# EAGLE design AS077_DCF77_Empfaenger (EAGLE 9.6.2)
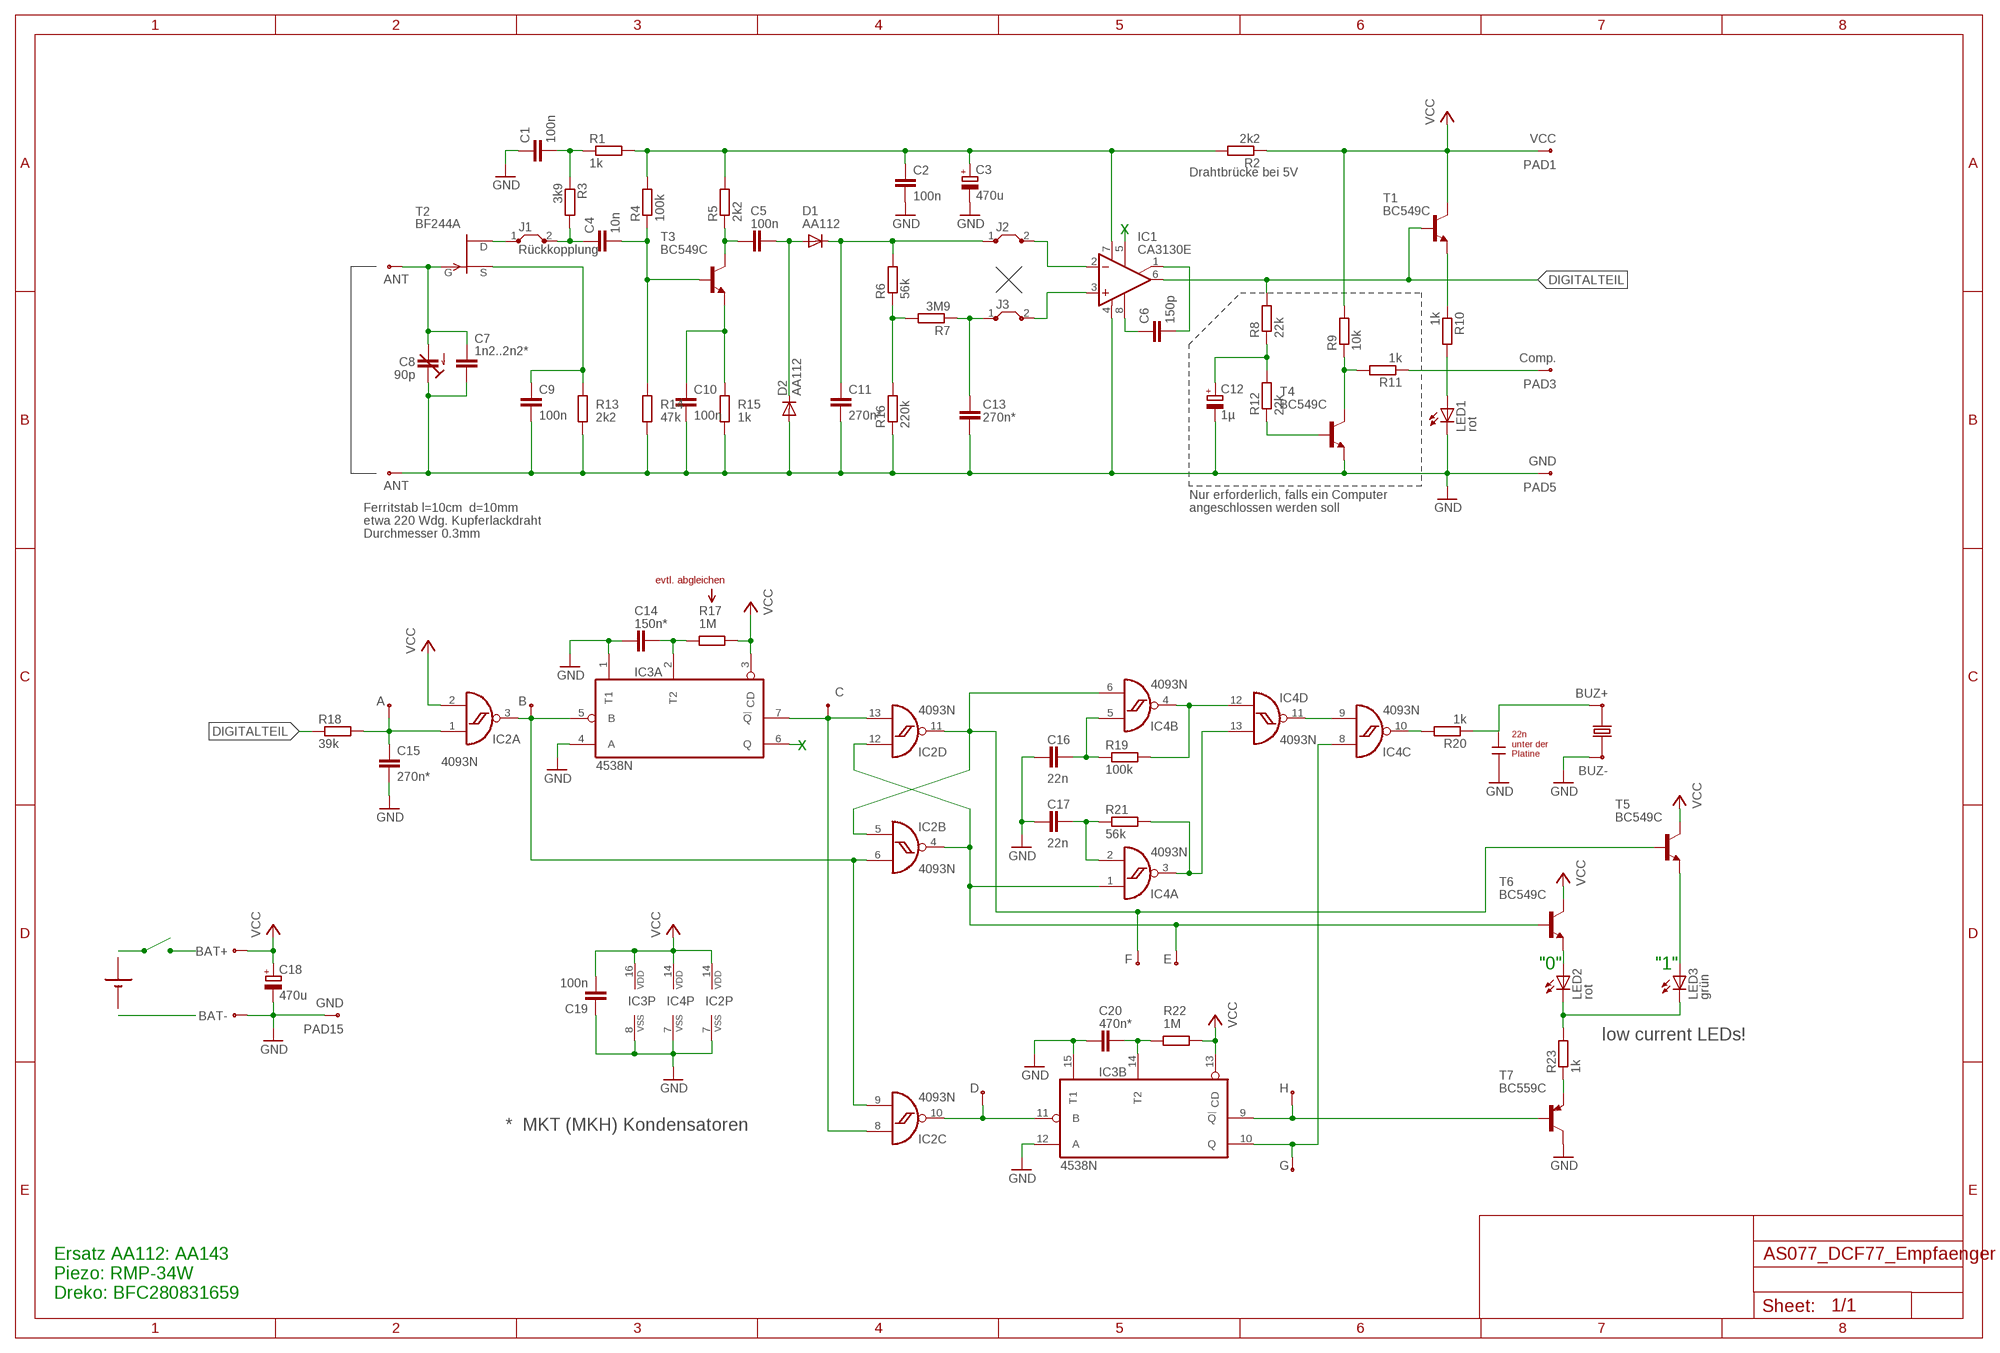
[diagram p0: schematic, sheet 1]

## Parts
C1  100n  RCL_C-EU050-024X044  [RCL_C050-024X044]
C2  100n  RCL_C-EU050-024X044  [RCL_C050-024X044]
C3  470u  RCL_CPOL-EUE5-10.5  [RCL_E5-10,5]
C4  10n  RCL_C-EU050-024X044  [RCL_C050-024X044]
C5  100n  RCL_C-EU050-024X044  [RCL_C050-024X044]
C6  150p  RCL_C-EU050-024X044  [RCL_C050-024X044]
C7  1n2..2n2*  RCL_C-EU075-032X103  [RCL_C075-032X103]
C8  90p  RCL_C-TRIMM808-7.5  [RCL_CTRIM808-BC7.5]
C9  100n  RCL_C-EU050-024X044  [RCL_C050-024X044]
C10  100n  RCL_C-EU050-024X044  [RCL_C050-024X044]
C11  270n*  RCL_C-EU075-032X103  [RCL_C075-032X103]
C12  1µ  RCL_CPOL-EUE5-6  [E5-6]
C13  270n*  RCL_C-EU075-032X103  [RCL_C075-032X103]
C14  150n*  RCL_C-EU075-032X103  [RCL_C075-032X103]
C15  270n*  RCL_C-EU075-032X103  [RCL_C075-032X103]
C16  22n  RCL_C-EU050-024X044  [RCL_C050-024X044]
C17  22n  RCL_C-EU050-024X044  [RCL_C050-024X044]
C18  470u  RCL_CPOL-EUE5-10.5  [RCL_E5-10,5]
C19  100n  RCL_C-EU050-024X044  [RCL_C050-024X044]
C20  470n*  RCL_C-EU075-032X103  [RCL_C075-032X103]
D1  AA112  DIODE_AA112  [DIODE_DO07]
D2  AA112  DIODE_AA112  [DIODE_DO07]
IC1  CA3130E  CA3130N  [DIL08]
IC2  4093N  40XX_4093N  [DIL14]
IC3  4538N  45XX_4538N  [DIL16]
IC4  4093N  40XX_4093N  [DIL14]
J1  Rückkopplung  JUMPER_J5MM  [JUMPER_05]
J2  JUMPER_J5MM  [JUMPER_05]
J3  JUMPER_J5MM  [JUMPER_05]
LED1  rot  LED_LED5MM  [LED_LED5MM]
LED2  rot  LED_LED5MM  [LED_LED5MM]
LED3  grün  LED_LED5MM  [LED_LED5MM]
PAD1  VCC  WIREPAD_2.2/1.3  [WIREPAD_2.2/1.3]
PAD2  ANT  WIREPAD_2.2/1.3  [WIREPAD_2.2/1.3]
PAD3  Comp.  WIREPAD_2.2/1.3  [WIREPAD_2.2/1.3]
PAD4  ANT  WIREPAD_2.2/1.3  [WIREPAD_2.2/1.3]
PAD5  GND  WIREPAD_2.2/1.3  [WIREPAD_2.2/1.3]
PAD6  A  WIREPAD_2.2/1.3  [WIREPAD_2.2/1.3]
PAD7  B  WIREPAD_2.2/1.3  [WIREPAD_2.2/1.3]
PAD8  C  WIREPAD_2.2/1.3  [WIREPAD_2.2/1.3]
PAD9  BUZ-  WIREPAD_2.2/1.3  [WIREPAD_2.2/1.3]
PAD10  BUZ+  WIREPAD_2.2/1.3  [WIREPAD_2.2/1.3]
PAD11  BAT+  WIREPAD_2.2/1.3  [WIREPAD_2.2/1.3]
PAD12  F  WIREPAD_2.2/1.3  [WIREPAD_2.2/1.3]
PAD13  E  WIREPAD_2.2/1.3  [WIREPAD_2.2/1.3]
PAD14  BAT-  WIREPAD_2.2/1.3  [WIREPAD_2.2/1.3]
PAD15  GND  WIREPAD_2.2/1.3  [WIREPAD_2.2/1.3]
PAD16  D  WIREPAD_2.2/1.3  [WIREPAD_2.2/1.3]
PAD17  H  WIREPAD_2.2/1.3  [WIREPAD_2.2/1.3]
PAD18  G  WIREPAD_2.2/1.3  [WIREPAD_2.2/1.3]
Q1  34MM_PIEZO  [34MM_PIEZO_SCREW]
R1  1k  RCL_R-EU_0207/5V  [RCL_0207/5V]
R2  2k2  RCL_R-EU_0207/5V  [RCL_0207/5V]
R3  3k9  RCL_R-EU_0207/15  [RCL_0207/15]
R4  100k  RCL_R-EU_0207/5V  [RCL_0207/5V]
R5  2k2  RCL_R-EU_0207/5V  [RCL_0207/5V]
R6  56k  RCL_R-EU_0207/5V  [RCL_0207/5V]
R7  3M9  RCL_R-EU_0207/5V  [RCL_0207/5V]
R8  22k  RCL_R-EU_0207/5V  [RCL_0207/5V]
R9  10k  RCL_R-EU_0207/5V  [RCL_0207/5V]
R10  1k  RCL_R-EU_0207/5V  [RCL_0207/5V]
R11  1k  RCL_R-EU_0207/5V  [RCL_0207/5V]
R12  22k  RCL_R-EU_0207/5V  [RCL_0207/5V]
R13  2k2  RCL_R-EU_0207/5V  [RCL_0207/5V]
R14  47k  RCL_R-EU_0207/5V  [RCL_0207/5V]
R15  1k  RCL_R-EU_0207/5V  [RCL_0207/5V]
R16  220k  RCL_R-EU_0207/5V  [RCL_0207/5V]
R17  1M  RCL_R-EU_0207/15  [RCL_0207/15]
R18  39k  RCL_R-EU_0207/15  [RCL_0207/15]
R19  100k  RCL_R-EU_0207/5V  [RCL_0207/5V]
R20  1k  RCL_R-EU_0207/5V  [RCL_0207/5V]
R21  56k  RCL_R-EU_0207/5V  [RCL_0207/5V]
R22  1M  RCL_R-EU_0207/15  [RCL_0207/15]
R23  1k  RCL_R-EU_0207/10  [RCL_0207/10]
T1  BC549C  BC549C5.08  [TO92_5.08]
T2  BF244A  BF244A5.08  [TO92_5.08]
T3  BC549C  BC549C5.08  [TO92_5.08]
T4  BC549C  BC549C5.08  [TO92_5.08]
T5  BC549C  BC549C2.54  [TO92_2.54]
T6  BC549C  BC549C2.54  [TO92_2.54]
T7  BC559C  BC559C5.08  [TO92_5.08]
U$1  9V_SILKSCREEN  [9V_BLOCK]

## Nets
DIGITALTEIL: IC1.6(OUT) R8.2 R18.1 T1.2(B)
GND: C1.1 C2.2 C3.- C7.2 C8.1(E) C8.3(E) C9.2 C10.2 C11.2 C12.- C13.2 C14.1 C15.2 C16.1 C17.1 C18.- C19.1 C20.1 D2.A IC1.4(V-) IC2.7(P:VSS) IC3.1(A:T1) IC3.4(A:A) IC3.8(P:VSS) IC3.12(B:A) IC3.15(B:T1) IC4.7(P:VSS) LED1.K(C) PAD4.1(P) PAD5.1(P) PAD9.1(P) PAD14.1(P) PAD15.1(P) R13.1 R14.1 R15.1 R16.1 T4.3(E) T7.1(C)
N$1: IC1.3(+IN) J3.2
N$2: IC1.2(-IN) J2.2
N$3: C13.1 J3.1 R7.1
N$4: R6.1 R7.2 R16.2
N$5: C11.1 D1.C J2.1 R6.2
N$6: C5.2 D1.A D2.C
N$7: C6.1 IC1.8(CMP)
N$8: C10.1 R15.2 T3.3(E)
N$9: C5.1 R5.1 T3.1(C)
N$10: C4.2 R4.1 R14.2 T3.2(B)
N$11: C2.1 C3.+ IC1.7(V+) R1.2 R2.2 R4.2 R5.2
N$12: C1.2 R1.1 R3.1
N$13: C4.1 J1.2 R3.2
N$14: J1.1 T2.3(D)
N$15: C9.1 R13.2 T2.1(S)
N$16: C6.2 IC1.1(ON/CMP)
N$17: PAD10.1(P) R20.1
N$18: C7.1 C8.2(A) PAD2.1(P) T2.2(G)
N$19: C20.2 IC3.14(B:T2) R22.2
N$20: C12.+ R8.1 R12.2
N$21: PAD3.1(P) R11.1
N$22: R12.1 T4.2(B)
N$23: R9.1 R11.2 T4.1(C)
N$24: LED1.A R10.2
N$25: R10.1 T1.3(E)
N$26: C15.1 IC2.1(A:I0) PAD6.1(P) R18.2
N$27: IC2.8(C:I0) IC2.13(D:I1) IC3.7(A:!Q) PAD8.1(P)
N$28: IC2.5(B:I0) IC2.11(D:O) IC4.6(B:I1) PAD12.1(P) T5.2(B)
N$29: IC4.4(B:O) IC4.12(D:I0) R19.2
N$30: IC2.3(A:O) IC2.6(B:I1) IC2.9(C:I1) IC3.5(A:B) PAD7.1(P)
N$31: IC2.10(C:O) IC3.11(B:B) PAD16.1(P)
N$32: IC2.4(B:O) IC2.12(D:I0) IC4.1(A:I0) PAD13.1(P) T6.2(B)
N$33: IC4.3(A:O) IC4.13(D:I1) R21.2
N$34: IC4.9(C:I1) IC4.11(D:O)
N$35: C16.2 IC4.5(B:I0) R19.1
N$36: C17.2 IC4.2(A:I1) R21.1
N$37: C14.2 IC3.2(A:T2) R17.2
N$38: IC3.10(B:Q) IC4.8(C:I0) PAD18.1(P)
N$39: IC3.9(B:!Q) PAD17.1(P) T7.2(B)
N$40: R23.1 T7.3(E)
N$41: LED2.A T6.3(E)
N$42: LED3.A T5.3(E)
N$43: LED2.K(C) LED3.K(C) R23.2
N$44: IC4.10(C:O) R20.2
N$45: IC3.6(A:Q)
N$46: IC1.5(ON)
VCC: C18.+ C19.2 IC2.2(A:I1) IC2.14(P:VDD) IC3.3(A:CD) IC3.13(B:CD) IC3.16(P:VDD) IC4.14(P:VDD) PAD1.1(P) PAD11.1(P) R2.1 R9.2 R17.1 R22.1 T1.1(C) T5.1(C) T6.1(C)

## Notes on the sheet
- Drahtbrücke bei 5V
- x
- Nur erforderlich, falls ein Computer
- Ferritstab l=10cm  d=10mm | angeschlossen werden soll
- etwa 220 Wdg. Kupferlackdraht
- Durchmesser 0.3mm
- evtl. abgleichen
- x
- 22n
  unter der
  Platine
- "0" | "1"
- low current LEDs!
- *  MKT (MKH) Kondensatoren
- Ersatz AA112: AA143
  Piezo: RMP-34W
  Dreko: BFC280831659

## Library data of the parts
C1 C2 C4-C7 C9-C11 C13-C17 C19 C20 = AS077_DCF77_Empfaenger:RCL_C-EU: CAPACITOR, European symbol
C3 C12 C18 = AS077_DCF77_Empfaenger:RCL_CPOL-EU: POLARIZED CAPACITOR, European symbol
C8 = AS077_DCF77_Empfaenger:RCL_C-TRIMM: Trimm capacitor
D1 D2 = AS077_DCF77_Empfaenger:DIODE_AA112: DIODE germanium
IC1 = AS077_DCF77_Empfaenger:CA3130: OP AMP
IC2 IC4 = AS077_DCF77_Empfaenger:40XX_4093: Quad 2-input NAND schmitt trigger
IC3 = AS077_DCF77_Empfaenger:45XX_4538: Dual precision monostable MULTIVIBRATOR
J1-J3 = AS077_DCF77_Empfaenger:JUMPER_J: Bridge
LED1-LED3 = AS077_DCF77_Empfaenger:LED_LED: LED OSRAM: - CHIPLED LG R971, LG N971, LY N971, LG Q971, LY Q971, LO R971, LY R971 LH N974, LH R974 LS Q976, LO Q976, LY Q976 LO Q996 - Hyper CHIPLED LW Q18S LB Q993, LB Q99A, LB R99A - SideLED LS A670, LO A670, LY A670, LG A670, LP A670 LB A673, LV A673, LT A673, LW A673 LH A674 LY A675 LS A676, LA A676, LO A676, LY A676, LW A676 LS A679, LY A679, LG A679 - Hyper Micro SIDELED® LS Y876, LA Y876, LO Y876, LY Y876 LT Y87S - SmartLED LW L88C, LW L88S LB L89C, LB L89S, LG L890 LS L89K, LO L89K, LY L89K LS L896, LA L896, LO L896, LY L896 - TOPLED LS T670, LO T670, LY T670, LG T670, LP T670 LSG T670, LSP T670, LSY T670, LOP T670, LYG T670 LG T671, LOG T671, LSG T671 LB T673, LV T673, LT T673, LW T673 LH T674 LS T676, LA T676, LO T676, LY T676, LB T676, LH T676, LSB T676, LW T676 LB T67C, LV T67C, LT T67C, LS T67K, LO T67K, LY T67K, LW E67C LS E67B, LA E67B, LO E67B, LY E67B, LB E67C, LV E67C, LT E67C LW T67C LS T679, LY T679, LG T679 LS T770, LO T770, LY T770, LG T770, LP T770 LB T773, LV T773, LT T773, LW T773 LH T774 LS E675, LA E675, LY E675, LS T675 LS T776, LA T776, LO T776, LY T776, LB T776 LHGB T686 LT T68C, LB T68C - Hyper Mini TOPLED® LB M676 - Mini TOPLED Santana® LG M470 LS M47K, LO M47K, LY M47K Source: http://www.osram.convergy.de LUXEON: - LUMILED® LXK2-PW12-R00, LXK2-PW12-S00, LXK2-PW14-U00, LXK2-PW14-V00 LXK2-PM12-R00, LXK2-PM12-S00, LXK2-PM14-U00 LXK2-PE12-Q00, LXK2-PE12-R00, LXK2-PE12-S00, LXK2-PE14-T00, LXK2-PE14-U00 LXK2-PB12-K00, LXK2-PB12-L00, LXK2-PB12-M00, LXK2-PB14-N00, LXK2-PB14-P00, LXK2-PB14-Q00 LXK2-PR12-L00, LXK2-PR12-M00, LXK2-PR14-Q00, LXK2-PR14-R00 LXK2-PD12-Q00, LXK2-PD12-R00, LXK2-PD12-S00 LXK2-PH12-R00, LXK2-PH12-S00 LXK2-PL12-P00, LXK2-PL12-Q00, LXK2-PL12-R00 Source: www.luxeon.com KINGBRIGHT: KA-3528ASYC Source: www.kingbright.com
PAD1-PAD18 = AS077_DCF77_Empfaenger:WIREPAD_2.2/1.3: THROUGH-HOLE PAD
Q1 = AS077_DCF77_Empfaenger:34MM_PIEZO
R1-R23 = AS077_DCF77_Empfaenger:RCL_R-EU_: RESISTOR, European symbol
T1 T3-T6 = AS077_DCF77_Empfaenger:BC549C: NPN Transistor
T2 = AS077_DCF77_Empfaenger:BF244A: N-Channel Junction FET http://www.onsemi.com/pub/Collateral/BF245A-D.PDF
T7 = AS077_DCF77_Empfaenger:BC559C: PNP Transistor
U$1 = AS077_DCF77_Empfaenger:9V_SILKSCREEN

## Board
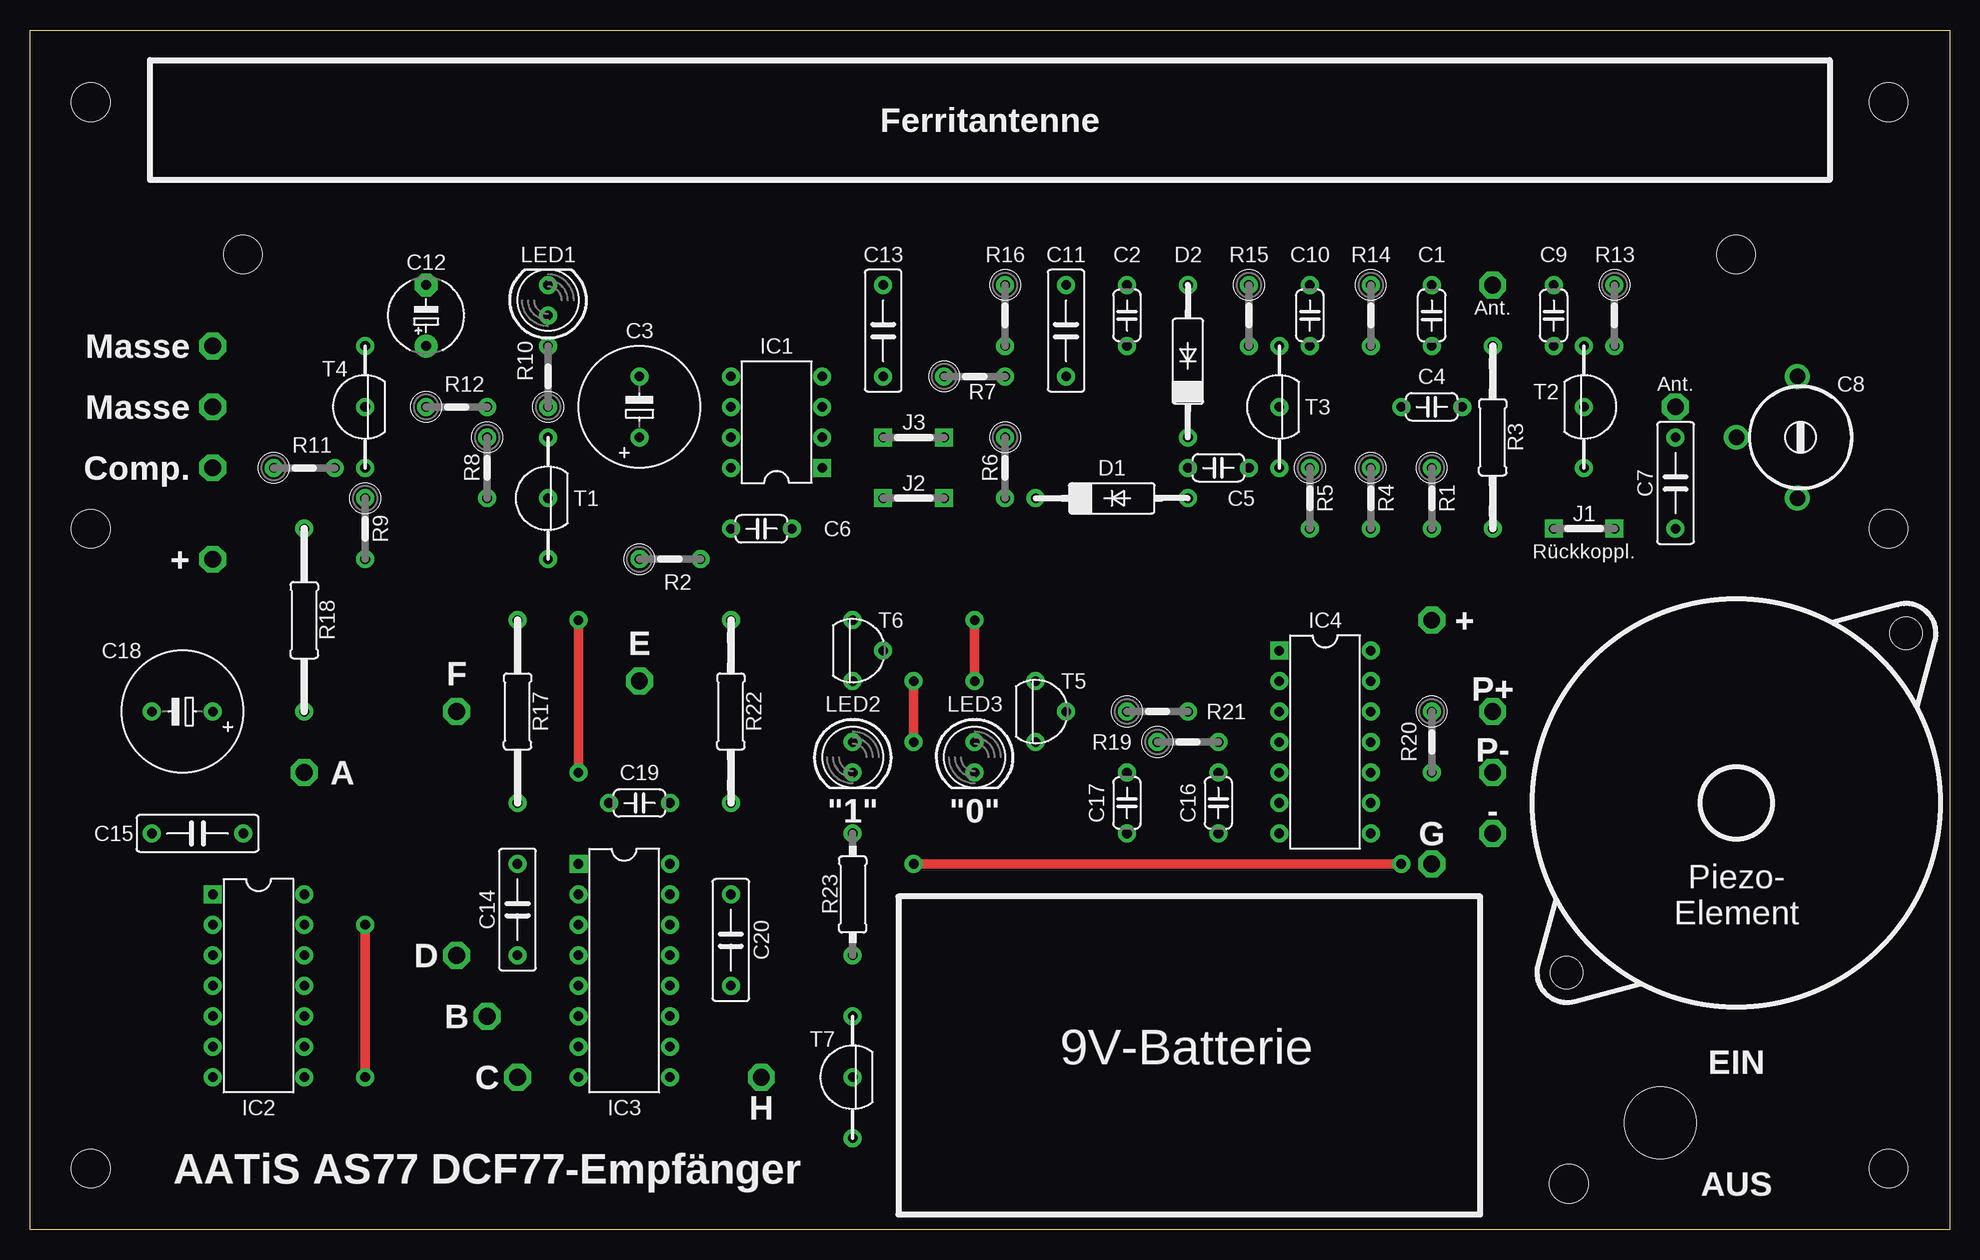
[diagram p1: board, top side]
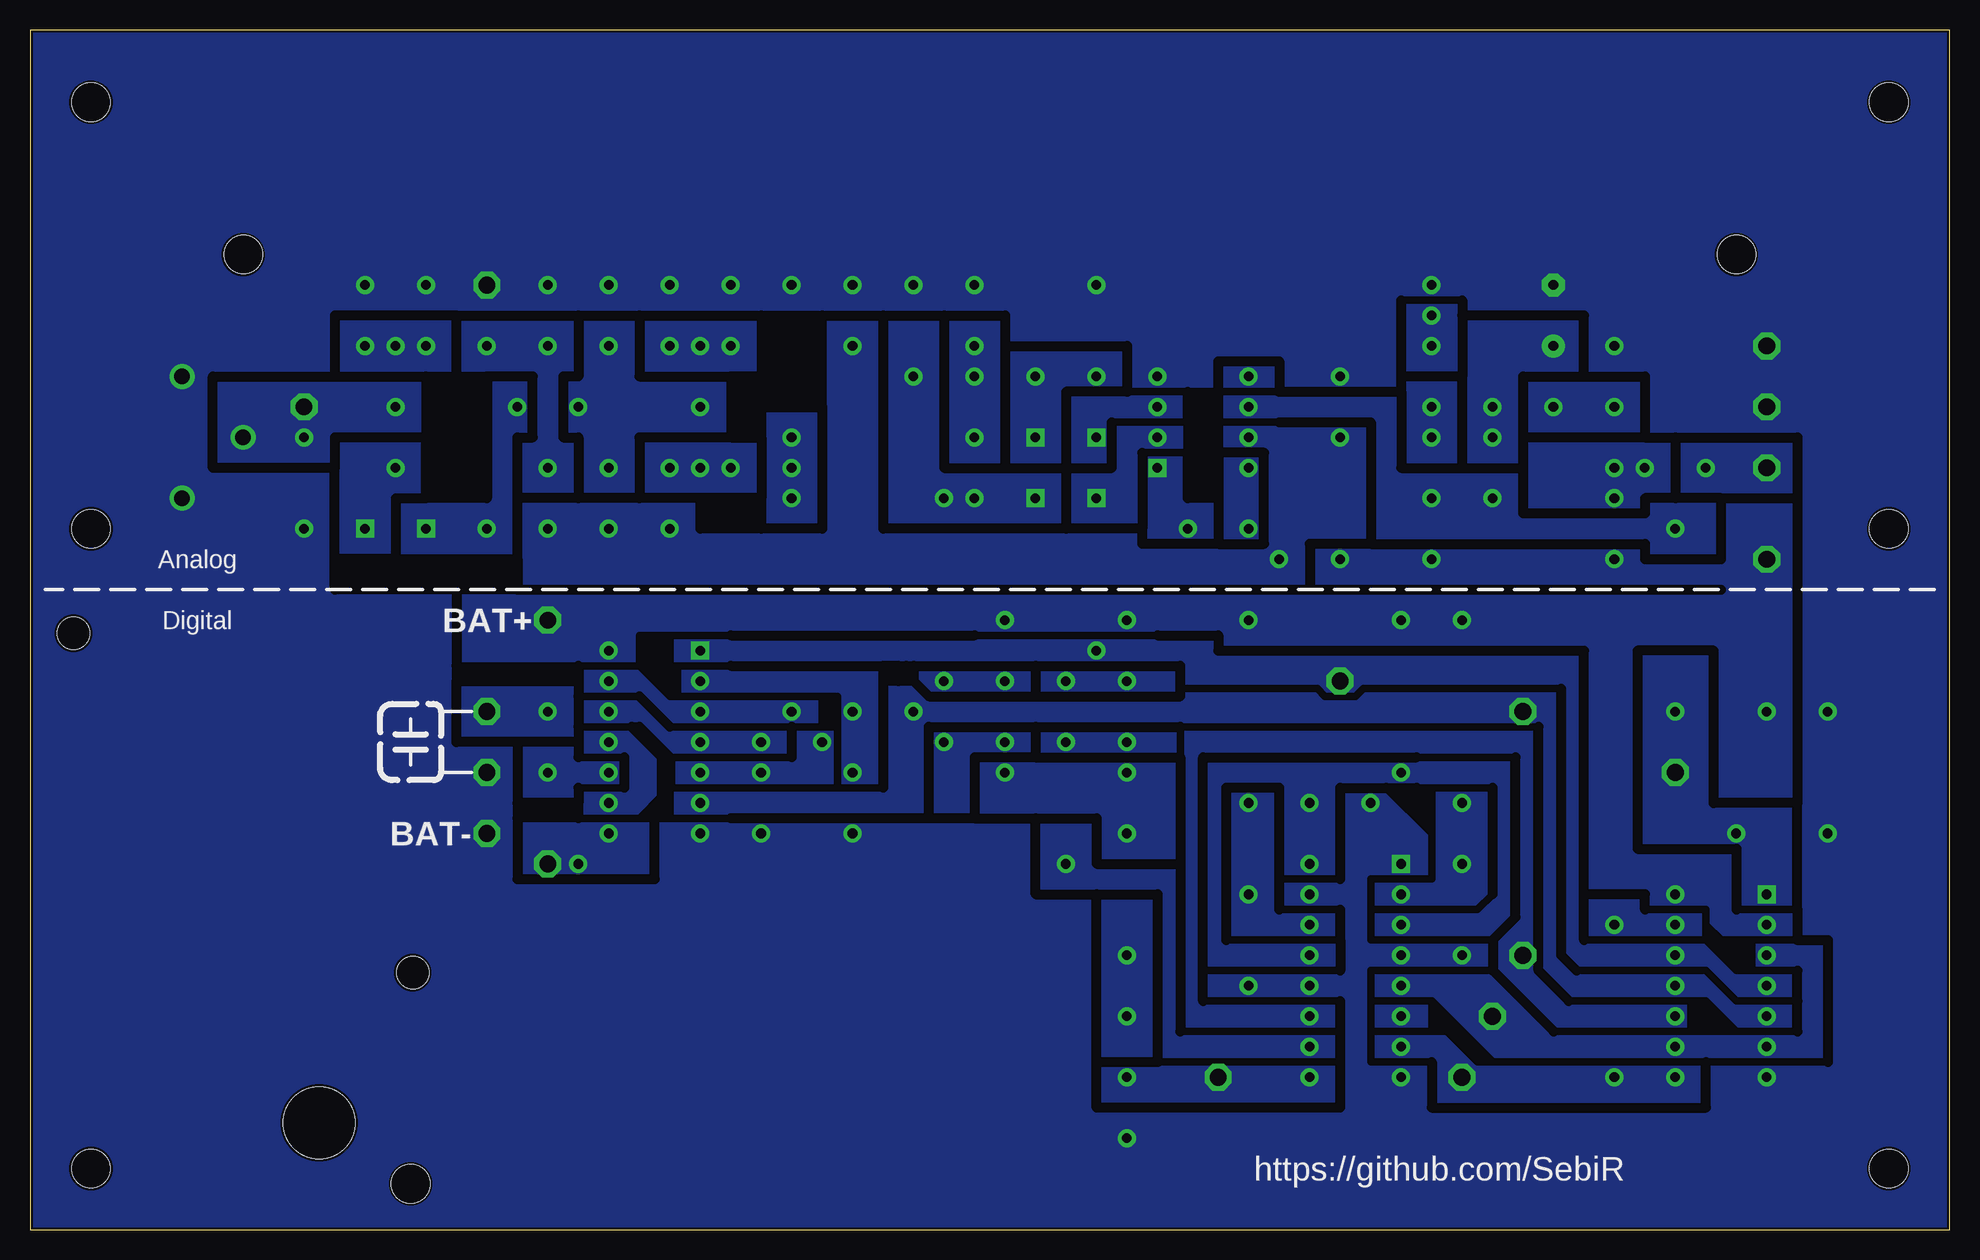
[diagram p2: board, bottom side, seen from below]

Size 160 x 100 mm. Coordinates in mm from the lower left corner, seen from the top.
Outline: 160,0 0,0 0,100 160,100 160,0
Copper layers (1*16): Top 0.035mm / dielectric 1.6mm / Bottom 0.035mm
Design rules "jlcpcb-2layers": minimum track width 0.2mm, minimum drill 0.3mm, track to track 5mil, track to pad 5mil, pad to pad 5mil, via to via 5mil, smd to smd 5mil, copper to edge 0.2mm, drill to drill 6mil, minimum pad ring 0.125mm, minimum via ring 0.125mm, stop-mask expansion 4mil, vias tented up to drill 0.5mm, thermal gap 10mil
Holes 3.2 mm at 154.92,93.98 5.06,93.98 154.92,5.08 5.06,5.08 5.06,58.42 154.92,58.42 17.76,81.28 142.22,81.28 128.27,3.81
Holes 6 mm at 135.89,8.89
bRestrict: area 121.9,61 to 127,71.1; area 94,68.6 to 99,76.2; area 99,66 to 101.6,71.1; area 99,58.4 to 104.1,61; area 60.9,61 to 63.5,69.8; area 119.4,53.3 to 134.6,55.9; area 114.3,45.7 to 124.4,47; area 106.7,36.2 to 107.3,39.4; area 92.7,41.9 to 94,44.5; area 106.7,34.3 to 109.2,36.8; area 114.3,34.3 to 119.4,35.6; area 43.2,33 to 47,36.8; 4 more areas; 356 lines

### Footprints (pad centres in the part's own frame; a part is rotated, then mirrored left to right if it is on the bottom)
RCL_C050-024X044 = drill 0.8 pad 1.5: 1 -2.54,0; 2 2.54,0
RCL_E5-10,5 = drill 0.8 pad 1.5: + -2.54,0; - 2.54,0
RCL_C075-032X103 = drill 0.8 pad 1.5: 1 -3.81,0; 2 3.81,0
RCL_CTRIM808-BC7.5 = drill 1.3 pad 2: 1 -5.08,0; 2 0,5.08; 3 5.08,0
E5-6 = drill 0.813 pad 1.905: + -2.54,0 | drill 0.813 pad 1.905 octagon: - 2.54,0
DIODE_DO07 = drill 0.8 pad 1.5: A 6.35,0; C -6.35,0
DIL08 = drill 0.8 pad 1.5 square: 1 -3.81,-3.81 | drill 0.8 pad 1.5: 2 -1.27,-3.81; 3 1.27,-3.81; 4 3.81,-3.81; 5 3.81,3.81; 6 1.27,3.81; 7 -1.27,3.81; 8 -3.81,3.81
DIL14 = drill 0.8 pad 1.5 square: 1 -7.62,-3.81 | drill 0.8 pad 1.5: 2 -5.08,-3.81; 3 -2.54,-3.81; 4 0,-3.81; 5 2.54,-3.81; 6 5.08,-3.81; 7 7.62,-3.81; 8 7.62,3.81; 9 5.08,3.81; 10 2.54,3.81; 11 0,3.81; 12 -2.54,3.81; 13 -5.08,3.81; 14 -7.62,3.81
DIL16 = drill 0.8 pad 1.5 square: 1 -8.89,-3.81 | drill 0.8 pad 1.5: 2 -6.35,-3.81; 3 -3.81,-3.81; 4 -1.27,-3.81; 5 1.27,-3.81; 6 3.81,-3.81; 7 6.35,-3.81; 8 8.89,-3.81; 9 8.89,3.81; 10 6.35,3.81; 11 3.81,3.81; 12 1.27,3.81; 13 -1.27,3.81; 14 -3.81,3.81; 15 -6.35,3.81; 16 -8.89,3.81
JUMPER_05 = drill 0.8 pad 1.5 square: 1 -2.54,0; 2 2.54,0
LED_LED5MM = drill 0.8 pad 1.5: A -1.27,0; K 1.27,0
WIREPAD_2.2/1.3 = drill 1.4 pad 2.2 octagon: 1 0,0
34MM_PIEZO_SCREW = hole 2.7: -20,0; 20,0
RCL_0207/5V = drill 0.8 pad 1.5: 1 -2.54,0; 2 2.54,0
RCL_0207/15 = drill 0.8 pad 1.5: 1 -7.62,0; 2 7.62,0
RCL_0207/10 = drill 0.8 pad 1.5: 1 -5.08,0; 2 5.08,0
TO92_5.08 = drill 0.8 pad 1.5: 1 -5.08,0; 2 0,0; 3 5.08,0
TO92_2.54 = drill 0.8 pad 1.5: 1 -2.54,0; 2 0,2.54; 3 2.54,0

### Placement (x,y rotation side)
C1  116.84,76.2 270 top
C2  91.44,76.2 90 top
C3  50.8,68.58 90 top
C4  116.84,68.58 180 top
C5  99.06,63.5 180 top
C6  60.96,58.42 0 top
C7  137.16,62.23 270 top
C8  147.32,66.04 90 top
C9  127,76.2 90 top
C10  106.68,76.2 90 top
C11  86.36,74.93 90 top
C12  33.02,76.2 90 top
C13  71.12,74.93 90 top
C14  40.64,26.67 90 top
C15  13.97,33.02 180 top
C16  99.06,35.56 90 top
C17  91.44,35.56 90 top
C18  12.7,43.18 180 top
C19  50.8,35.56 0 top
C20  58.42,24.13 90 top
D1  90.17,60.96 0 top
D2  96.52,72.39 90 top
IC1  62.23,67.31 90 top
IC2  19.05,20.32 270 top
IC3  49.53,21.59 270 top
IC4  107.95,40.64 270 top
J1  129.54,58.42 180 top
J2  73.66,60.96 180 top
J3  73.66,66.04 180 top
LED1  43.18,77.47 90 top
LED2  68.58,39.37 270 top
LED3  78.74,39.37 270 top
PAD1  15.24,55.88 0 top
PAD2  137.16,68.58 0 top
PAD3  15.24,63.5 0 top
PAD4  121.92,78.74 0 top
PAD5  15.24,68.58 0 top
PAD6  22.86,38.1 0 top
PAD7  38.1,17.78 0 top
PAD8  40.64,12.7 0 top
PAD9  121.92,38.1 0 top
PAD10  121.92,43.18 0 top
PAD11  116.84,50.8 0 top
PAD12  35.56,43.18 0 top
PAD13  50.8,45.72 0 top
PAD14  121.92,33.02 0 top
PAD15  15.24,73.66 0 top
PAD16  35.56,22.86 0 top
PAD17  60.96,12.7 0 top
PAD18  116.84,30.48 0 top
Q1  142.24,35.56 45 top
R1  116.84,60.96 270 top
R2  53.34,55.88 0 top
R3  121.92,66.04 270 top
R4  111.76,60.96 270 top
R5  106.68,60.96 270 top
R6  81.28,63.5 270 top
R7  78.74,71.12 0 top
R8  38.1,63.5 270 top
R9  27.94,58.42 270 top
R10  43.18,71.12 90 top
R11  22.86,63.5 0 top
R12  35.56,68.58 0 top
R13  132.08,76.2 270 top
R14  111.76,76.2 270 top
R15  101.6,76.2 270 top
R16  81.28,76.2 270 top
R17  40.64,43.18 270 top
R18  22.86,50.8 270 top
R19  96.52,40.64 0 top
R20  116.84,40.64 270 top
R21  93.98,43.18 0 top
R22  58.42,43.18 270 top
R23  68.58,27.94 90 top
T1  43.18,60.96 90 top
T2  129.54,68.58 270 top
T3  104.14,68.58 90 top
T4  27.94,68.58 90 top
T5  83.82,43.18 270 top
T6  68.58,48.26 270 top
T7  68.58,12.7 90 top
U$1  72.39,1.27 0 top

### Tracks (layer width: path | path; a pad name or v marks a point on that pad's centre or on a via)
DIGITALTEIL
  pour Bottom (no thermals): 19.05,60.96 19.05,55.88 25.4,55.88 25.4,57.15 48.26,57.15 48.26,67.31 60.96,67.31 60.96,69.85 47.62,69.85 45.72,69.85 45.72,63.5 35.56,63.5 35.56,59.69 25.4,59.69 25.4,60.96
GND
  pour Bottom (no thermals): 0,0 0,100 160,100 160,0
N$1
  pour Bottom (no thermals): 63.5,69.85 73.66,69.85 73.66,63.5 69.85,63.5 69.85,67.31 63.5,67.31
N$2
  pour Bottom (no thermals): 63.5,67.31 69.22,67.31 69.85,67.31 69.85,63.5 73.66,63.5 73.66,58.42 67.31,58.42 67.31,64.77 63.5,64.77
N$3
  pour Bottom (no thermals): 68.58,73.66 78.74,73.66 78.74,63.5 73.66,63.5 73.66,69.85 68.58,69.85
N$4
  pour Bottom (no thermals): 78.74,76.2 83.82,76.2 83.82,63.5 78.74,63.5
N$5
  pour Bottom (no thermals): 73.66,63.5 83.82,63.5 83.82,76.2 88.9,76.2 88.9,58.42 73.66,58.42
N$6
  pour Bottom (no thermals): 93.98,68.58 93.98,58.42 99.06,58.42 99.06,68.58
N$7
  pour Bottom (no thermals): 57.15,64.77 60.96,64.77 60.96,57.15 57.15,57.15
N$8
  pour Bottom (no thermals): 99.06,76.2 109.22,76.2 109.22,71.12 99.06,71.12
N$9
  pour Bottom (no thermals): 99.06,66.04 109.22,66.04 109.22,60.96 99.06,60.96
N$10
  pour Bottom (no thermals): 101.6,71.12 101.6,66.04 109.22,66.04 109.22,60.96 114.3,60.96 114.3,66.04 115.57,66.04 115.57,71.12 114.3,71.12 114.3,76.2 109.22,76.2 109.22,71.12
N$11
  pour Bottom (no thermals): 60.96,67.31 60.96,64.77 57.15,64.77 57.15,57.15 67.31,57.15 67.31,58.42 88.9,58.42 88.9,67.94 88.9,76.2 93.98,76.2 93.98,58.42 104.14,58.42 104.14,60.96 119.38,60.96 119.38,53.34 85.09,53.34 53.34,53.34 53.34,57.15 48.26,57.15 48.26,67.31
N$12
  pour Bottom (no thermals): 114.3,76.2 124.46,76.2 124.46,71.12 118.11,71.12 118.11,66.04 119.38,66.04 119.38,60.96 114.3,60.96 114.3,66.04 115.57,66.04 115.57,71.12 114.3,71.12
N$13
  pour Bottom (no thermals): 119.38,55.88 129.54,55.88 129.54,60.96 121.92,60.96 121.92,71.12 118.11,71.12 118.11,66.04 119.38,66.04
N$14
  pour Bottom (no thermals): 127,60.96 127,66.04 134.62,66.04 134.62,55.88 129.54,55.88 129.54,60.96
N$15
  pour Bottom (no thermals): 124.46,76.2 134.62,76.2 134.62,71.12 124.46,71.12
N$16
  pour Bottom (no thermals): 63.5,64.77 67.31,64.77 67.31,57.15 60.96,57.15 60.96,60.96 63.5,60.96
N$17
  pour Bottom (no thermals): 114.3,40.64 124.46,40.64 124.46,45.72 114.3,45.72
N$18
  pour Bottom (no thermals): 127,71.12 144.78,71.12 144.78,63.5 134.62,63.5 134.62,66.04 127,66.04
N$19
  pour Bottom (no thermals): 50.8,24.13 60.33,24.13 60.33,36.83 55.88,36.83 55.88,26.67 50.8,26.67
N$20
  pour Bottom (no thermals): 30.48,76.2 40.64,76.2 40.64,63.5 35.56,63.5 35.56,71.12 30.48,71.12
N$21
  pour Bottom (no thermals): 12.7,66.04 22.86,66.04 22.86,60.96 12.7,60.96
N$22
  pour Bottom (no thermals): 25.4,71.12 35.56,71.12 35.56,66.04 25.4,66.04
N$23
  pour Bottom (no thermals): 22.86,66.04 35.56,66.04 35.56,59.69 25.4,59.69 25.4,60.96 22.86,60.96
N$24
  pour Bottom (no thermals): 40.64,77.47 45.72,77.47 45.72,71.12 40.64,71.12
N$25
  pour Bottom (no thermals): 40.64,71.12 45.72,71.12 45.72,63.5 40.64,63.5
N$26
  pour Bottom (no thermals): 12.7,26.67 17.78,26.67 17.78,31.75 26.04,31.75 26.04,48.26 19.68,48.26 19.68,35.56 12.7,35.56
N$27  (via drill 0.8 pad 1.5)
  Top 0.8: v27.94,25.4 v27.94,12.7
  pour Bottom (no thermals): 20.32,26.67 25.4,26.67 25.4,27.94 30.48,27.94 30.48,24.13 20.32,24.13
  pour Bottom (no thermals): 20.32,10.16 43.18,10.16 43.18,13.97 48.26,13.97 48.26,16.51 41.91,16.51 39.37,13.97 20.32,13.97
N$28
  pour Bottom (no thermals): 12.7,16.51 17.78,16.51 20.32,19.05 31.75,19.05 34.29,21.59 34.29,27.3 34.29,41.91 85.09,41.91 85.09,34.29 106.68,34.29 106.68,36.83 88.9,36.83 88.9,45.72 86.36,45.72 85.09,44.45 64.14,44.45 64.14,45.09 52.7,45.09 52.07,44.45 49.53,44.45 48.9,45.09 32.38,45.09 32.38,22.86 31.11,21.59 20.32,21.59 17.78,19.05 12.7,19.05
N$29
  pour Bottom (no thermals): 96.52,39.37 106.68,39.37 109.22,41.91 114.3,41.91 114.3,44.45 109.22,44.45 106.68,41.91 96.52,41.91
N$30
  pour Bottom (no thermals): 17.14,24.13 10.16,24.13 10.16,13.97 38.1,13.97 43.18,19.05 48.26,19.05 48.26,21.59 38.1,21.59 33.02,16.51 12.7,16.51 12.7,21.59 17.14,21.59
N$31
  pour Bottom (no thermals): 21.59,19.05 21.59,16.51 33.02,16.51 38.1,21.59 38.1,24.13 36.2,26.04 36.2,31.75 36.2,39.37 62.23,39.37 62.23,19.05 50.8,19.05 50.8,16.51 64.14,16.51 64.14,34.29 64.14,41.91 34.29,41.91 34.29,21.59 31.75,19.05
N$32
  pour Bottom (no thermals): 12.7,19.05 17.78,19.05 20.32,21.59 31.11,21.59 32.38,22.86 32.38,45.09 48.9,45.09 49.53,44.45 52.07,44.45 52.7,45.09 64.14,45.09 64.14,46.99 76.2,46.99 90.17,46.99 106.68,46.99 106.68,49.53 97.16,49.53 86.36,49.53 76.2,49.53 65.41,49.53 60.96,49.53 60.96,48.26 56.52,48.26 43.81,48.26 30.48,48.26 30.48,37.47 30.48,29.84 30.48,24.13 20.32,24.13 17.78,21.59 12.7,21.59
N$33
  pour Bottom (no thermals): 93.98,41.91 106.68,41.91 109.22,44.45 114.3,44.45 114.3,46.99 109.22,46.99 106.68,44.45 93.98,44.45
N$34
  pour Bottom (no thermals): 114.3,41.91 109.86,41.91 107.31,39.37 107.31,36.2 109.22,34.29 114.3,34.29 114.3,36.83 110.49,36.83 110.49,39.37 114.3,39.37
N$35
  pour Bottom (no thermals): 92.71,41.91 92.71,36.83 106.68,36.83 106.68,39.37 96.52,39.37 96.52,41.91
N$36
  pour Bottom (no thermals): 88.9,36.83 92.71,36.83 92.71,44.45 106.05,44.45 106.05,46.99 88.9,46.99
N$37
  pour Bottom (no thermals): 48.26,26.67 39.37,26.67 38.1,27.94 38.1,36.83 43.18,36.83 43.18,29.21 48.26,29.21
N$38  (via drill 0.8 pad 1.5)
  Top 0.8: v73.66,30.48 v114.3,30.48
  pour Bottom (no thermals): 50.8,13.97 66.04,13.97 66.04,27.94 76.2,27.94 76.2,34.29 71.12,34.29 71.12,30.48 64.14,30.48 64.14,16.51 50.8,16.51
  pour Bottom (no thermals): 107.95,34.29 107.95,29.21 119.38,29.21 119.38,34.29
N$39
  pour Bottom (no thermals): 50.8,10.16 71.12,10.16 71.12,13.97 50.8,13.97
N$40
  pour Bottom (no thermals): 66.04,13.97 71.12,13.97 71.12,27.94 66.04,27.94
N$41  (via drill 0.8 pad 1.5)
  Top 0.8: v73.66,45.72 v73.66,40.64
  pour Bottom (no thermals): 64.14,39.37 81.28,39.37 81.28,34.29 85.09,34.29 85.09,41.91 64.14,41.91
  pour Bottom (no thermals): 64.14,44.45 76.2,44.45 76.2,46.99 64.14,46.99
N$42
  pour Bottom (no thermals): 76.2,41.91 85.09,41.91 85.09,34.29 81.28,34.29 81.28,39.37 76.2,39.37
N$43
  pour Bottom (no thermals): 64.14,30.48 71.12,30.48 71.12,34.29 81.28,34.29 81.28,39.37 64.14,39.37
N$44
  pour Bottom (no thermals): 110.49,39.37 114.3,39.37 114.3,40.64 119.38,40.64 119.38,35.56 114.3,35.56 114.3,36.83 110.49,36.83
N$45
  pour Bottom (no thermals): 43.18,19.05 48.26,19.05 48.26,16.51 43.18,16.51
N$46
  pour Bottom (no thermals): 55.88,72.39 60.96,72.39 60.96,69.85 55.88,69.85
VCC  (via drill 0.8 pad 1.5)
  Top 0.8: v45.72,50.8 v45.72,38.1 | v78.74,50.8 v78.74,45.72
  pour Bottom (no thermals): 12.7,26.67 12.7,24.13 19.05,24.13 20.32,25.4 20.32,26.67 25.4,26.67 25.4,27.94 30.48,27.94 30.48,48.26 60.96,48.26 60.96,49.53 66.04,49.53 109.22,49.53 109.22,46.99 124.46,46.99 124.46,53.34 53.34,53.34 53.34,57.15 25.4,57.15 25.4,55.88 19.05,55.88 19.05,60.96 12.7,60.96 12.7,35.56 19.68,35.56 19.68,48.26 26.04,48.26 26.04,31.75 17.78,31.75 17.78,26.67
  pour Bottom (no thermals): 48.26,24.13 38.1,24.13 36.2,26.04 36.2,39.37 62.23,39.37 62.23,21.59 50.8,21.59 50.8,24.13 60.33,24.13 60.33,36.83 55.88,36.83 55.88,29.21 50.8,29.21 50.8,36.83 43.18,36.83 38.1,36.83 38.1,27.94 39.37,26.67 48.26,26.67
  pour Bottom (no thermals): 76.2,44.45 85.09,44.45 86.36,45.72 86.36,46.99 76.2,46.99

### Text on the board
tPlace: Ant. | Masse | Ant. | Masse | Comp. | Rückkoppl. | + | + | E | F | P+ | P- | A | "1" | "0" | - | G | D | B | EIN | C | H | AATiS AS77 DCF77-Empfänger | AUS
bPlace: Analog | BAT+ | Digital | BAT- | https://github.com/SebiR
tNames: Ferritantenne | Piezo- / Element
bStop: DK2ZA